# Altium schematic sheet pfe-final.SchDoc: Conception et réalisation d'un caractériseur des modles photovoltaiques
size A4; ApprovedBy: Hanen Zormati; CheckedBy: Hanen Zormati; CompanyName: CRMN; DrawnBy: Asma Boulajfene; Engineer: Embedded System; DocumentNumber: 1; SheetNumber: 1; SheetTotal: 1
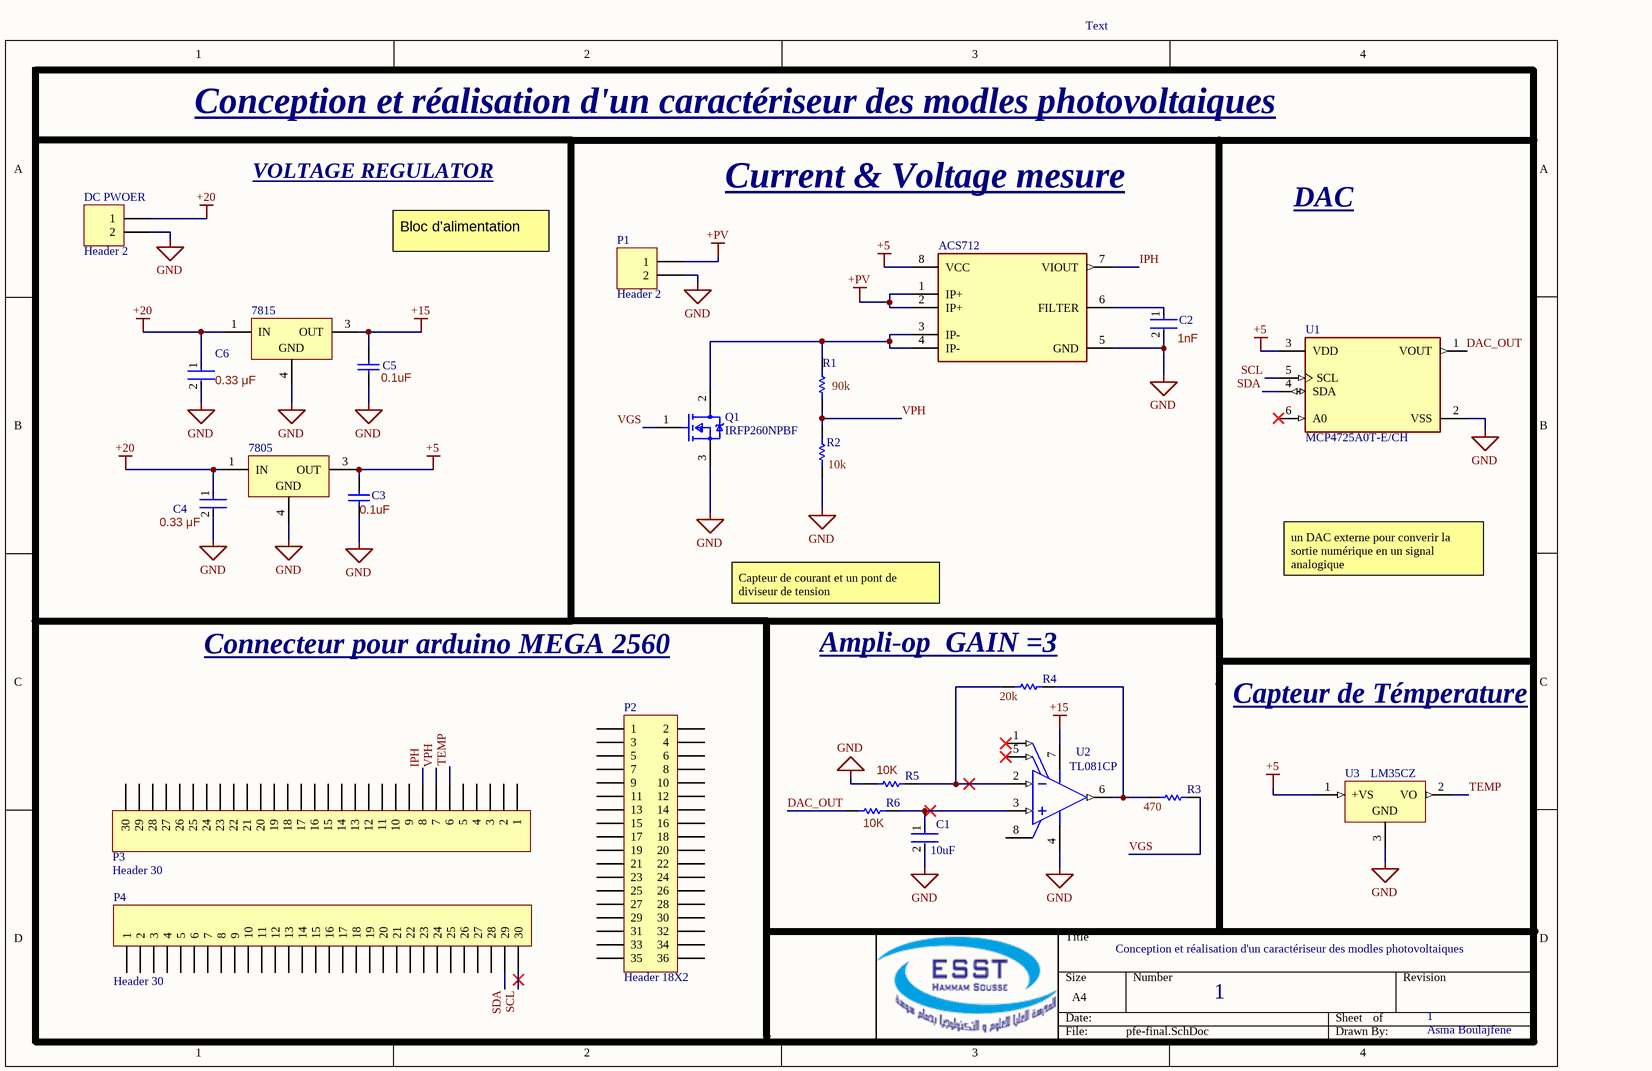
[diagram p0: pfe-final.SchDoc]

## Parts
7805  L7805CD2T-TR  [TO-263_M]  (value not drawn)
7815  L7815CD2T-TR  [TO-263_N]  (value not drawn)
ACS712  ACS712ELCTR-30A-T  [FP-LC-8-IPC_C]  (value not drawn)
C1  value 10uF  [FP-C0805C-DG-MFG]  (hidden comment: C0805C106K8PACTU)
C2  value 1nF  [FP-C0805C-DN-MFG]  (hidden comment: C0805C102J1GACTU)
C3  Capacitance: 0.1uF  [CAPC2013X135X45ML10T25]  (hidden comment: GRM21BR71H104KA01L)
C4  value 0.33 μF  [FP-C0805C-DN-MFG]  (hidden comment: C0805C334K5RACTU)
C5  Capacitance: 0.1uF  [CAPC2013X135X45ML10T25]  (hidden comment: GRM21BR71H104KA01L)
C6  value 0.33 μF  [FP-C0805C-DN-MFG]  (hidden comment: C0805C334K5RACTU)
DC_PWOER  Header 2  [HDR1X2]
P1  Header 2  [HDR1X2]
P2  Header 18X2  [HDR2X18]
P3  Header 30  [HDR1X30]
P4  Header 30  [HDR1X30]
Q1  IRFP260NPBF  [FP-PG-TO247-3-MFG]
R1  value 90k  [RESC0805(2012)_M]  (hidden comment: 150K 1% 0805(2012))
R2  value 10k  [RESC2013X60X35NL10T20]  (hidden comment: RC0805FR-0710KL)
R3  value 470  [RESC2013X60X35NL10T20]  (hidden comment: RC0805FR-0710KL)
R4  value 20k  [RESC2013X60X35NL10T20]  (hidden comment: RC0805FR-0710KL)
R5  value 10K  [RESC2013X60X35NL10T20]  (hidden comment: RC0805FR-0710KL)
R6  value 10K  [RESC2013X60X35NL10T20]  (hidden comment: RC0805FR-0710KL)
U1  MCP4725A0T-E/CH  [FP-C04-028-CHY-IPC_B]
U2  TL081CP  [P0008A]
U3  LM35CZ  [Z03A]

## Nets
+5: 7805.3(OUT) ACS712.8(VCC) C3.2 U1.3(VDD) U3.1(+VS)
+15: 7815.3(OUT) C5.2 U2.7(VCC+)
+20: 7805.1(IN) 7815.1(IN) C4.1 C6.1 DC_PWOER.1
+PV: ACS712.1(IP+) ACS712.2(IP+) P1.1
GND: 7805.4(GND) 7815.4(GND) ACS712.5(GND) C1.2 C2.2 C3.1 C4.2 C5.1 C6.2 DC_PWOER.2 P1.2 Q1.3(S) R2.1 R5.1 U1.2(VSS) U2.4(VCC-) U3.3(GND)
DAC_OUT: R6.1 U1.1(VOUT)
IPH: ACS712.7(VIOUT) P3.8
SCL: P4.30 U1.5(SCL)
SDA: P4.29 U1.4(SDA)
TEMP: P3.6 U3.2(VO)
VGS: Q1.1(G) R3.2
VPH: P3.7 R1.1 R2.2
NetACS712_3: ACS712.3(IP-) ACS712.4(IP-) Q1.2(D) R1.2
NetACS712_6: ACS712.6(FILTER) C2.1
NetC1_1: C1.1 R6.2 U2.3(IN+)
NetR3_1: R3.1 R4.2 U2.6(OUT)
NetR4_1: R4.1 R5.2 U2.2(IN-)

Not connected (* = marked no-connect by the designer): P2 1 2 3 4 5 6 7 8 9 10 11 12 13 14 15 16 17 18 19 20 21 22 23 24 25 26 27 28 29 30 31 32 33 34 35 36; P3 1 2 3 4 5 9 10 11 12 13 14 15 16 17 18 19 20 21 22 23 24 25 26 27 28 29 30; P4 1 2 3 4 5 6 7 8 9 10 11 12 13 14 15 16 17 18 19 20 21 22 23 24 25 26 27 28; U1 6(A0)*; U2 1(OFFSET_N1)* 5(OFFSET_N2)* 8(NC)

## Notes on the sheet
- Text
- Conception et réalisation d'un caractériseur des modles photovoltaiques
- VOLTAGE REGULATOR
- Current & Voltage mesure
- DAC
- Bloc d'alimentation
- Capteur de courant et un pont de diviseur de tension
- un DAC externe pour converir la sortie numérique en un signal analogique
- Connecteur pour arduino MEGA 2560
- (near R4) Ampli-op  GAIN =3
- Capteur de Témperature
- 1
- Asma Boulajfene

## Library data of the parts
7805 = CMP-0244-00213-1: Positive Voltage Regulator, 3-Pin D2PAK, Tape and Reel; PackageReference: TO-263; ComponentLink2URL: http://www.st.com/internet/com/TECHNICAL_RESOURCES/TECHNICAL_LITERATURE/DATASHEET/CD00000444.pdf; PackageDescription: 3-Pin Transistor Outline Package 2.54 mm Pitch, 15.4 mm Lead Span (D2PAK); DatasheetVersion: 16/11/2011; ComponentLink2Description: Datasheet; ComponentLink1Description: Manufacturer URL; PackageVersion: 2011; ComponentLink1URL: http://www.st.com
7815 = CMP-0244-00179-1: Positive Voltage Regulator, 3-Pin D2PAK, Tape and Reel; PackageReference: TO-263; ComponentLink2Description: Datasheet; ComponentLink1Description: Manufacturer URL; DatasheetVersion: 16/11/2011; PackageVersion: 2011; ComponentLink1URL: http://www.st.com; ComponentLink2URL: http://www.st.com/internet/com/TECHNICAL_RESOURCES/TECHNICAL_LITERATURE/DATASHEET/CD00000444.pdf; PackageDescription: 3-Pin Transistor Outline Package 2.54 mm Pitch, 15.4 mm Lead Span (D2PAK)
ACS712 = CMP-2000-04990-2: SENSOR CURRENT HALL 30A AC/DC; Bandwidth: 80kHz; Max Supply Current: 13mA; Linearity: 1.5%; Operating Supply Voltage: 5V; Quiescent Current: 10mA; Number of Channels: 1; Polarity: Bidirectional; Min Supply Voltage: 4.5V; Response Time: 5us; Sensitivity: 66mV/A; Max Supply Voltage: 5.5V; Current Sensing: 30A; REACH SVHC: No SVHC; Mount: Surface Mount; Max Operating Temperature: 85°C; Packaging: Cut Tape; Frequency: 80kHz; Series: -; Termination: SMD/SMT; RoHS Compliant: Yes; Number of Pins: 8; Package Quantity: 1; Accuracy: 1.5%; Lead Free: Lead Free; Case/Package: SOIC; Min Operating Temperature: -40°C; Output Current: 10mA
C1 = CMP-2007-03243-2: CAP CER 10UF 10V X5R 0805; Manufacturer: Kemet; 3DS Part Number: 220-00001; Tolerance: 10%; Temperature Coefficient: 15%; Material: Ceramic; Device Class L2: Capacitors; Device Class L1: Passive Components; ComponentLink2URL: https://content.kemet.com/datasheets/KEM_C1006_X5R_SMD.pdf; Height: 1.4mm; Lead Free: Yes; Manufacturer Part Number: C0805C106K8PACTU; Digikey Description: CAP CER 10UF 10V X5R 0805; Octopart: https://octopart.com/c0805c106k8pactu-kemet-98697; Capacitance: 10uF; Temperature Range Low: -55°C; Temperature: -55°C to +85°C; Automotive: No; Mouser Description: CAP CER 10UF 10V X5R 0805; Ipc Land Pattern Name: CAPC200125X125; Temperature Range High: +85°C; Voltage: 10V; RoHS: TRUE; Device Class L3: Ceramic Capacitors; ComponentLink2Description: Datasheet; Voltage Rating: 10V; Package: C0805C-DG; Temperature Characteristic: X5R; Category: Cap
C2 = CMP-2007-00233-2: CAP CER 1000PF 100V C0G/NP0 0805; Manufacturer: KEMET; Capacitance: 1,000 pF; Temperature Coefficient: 30ppm/°C; Material: Ceramic; Tolerance: 0.05; Temperature Characteristic: C0G; Device Class L2: Capacitors; Ipc Land Pattern Name: CAPC200125X78; Device Class L1: Passive Components; Package: C0805C-DN; Lead Free: Yes; ComponentLink2URL: https://content.kemet.com/datasheets/KEM_C1003_C0G_SMD.pdf; RoHS: TRUE; Mouser Description: Multilayer Ceramic Capacitors MLCC - SMD/SMT 100volts 1000pF C0G 5%; Octopart: https://octopart.com/c0805c102j1gactu-kemet-105157; Category: Cap; Digikey Description: CAP CER 1000PF 100V C0G/NP0 0805; Temperature Range High: +125°C; Automotive: No; Temperature: -55°C to +125°C; Height: 0.88mm; ComponentLink2Description: Datasheet; Manufacturer Part Number: C0805C102J1GACTU; Temperature Range Low: -55°C; Device Class L3: Ceramic Capacitors; Voltage Rating: 100 V
C3 C5 = CMP-2100-03644-1: Chip Capacitor, 0.1 uF, +/- 10%, 50 V, -55 to 125 degC, 0805 (2012 Metric), RoHS, Tape and Reel; Manufacturer: Murata; Voltage: 50V; Insulation Resistance: 10GR; Dielectric Material: Ceramic; Dielectric: X7R; Package Description: 2-Pin Surface Mount Device, Body 2 x 1.25 mm; Manufacturer URL: http://www.murata.com/; Case Code (Imperial): 0805; Datasheet URL: http://psearch.en.murata.com/capacitor/product/GRM21BR71H104KA01%23.pdf; Termination: SMD/SMT; Lead Free: LeadFree; Package Quantity: 1; Mount: SurfaceMount; REACH SVHC: Unknown; Thickness: 0.053inch; Height: 1.25mm; Case/Package: 0805; Voltage Rating: 50V; Width: 0.049inch; Case Code (Metric): 2012; Material: Ceramic; Min Operating Temperature: -55degC; RoHSCompliant: true; Datasheet Version: 42675.0; Voltage Rating (DC): 50V; Tolerance: 10%; Package Reference: 0805; Depth: 1.25mm; Length: 2mm; Max Operating Temperature: 125degC; Packaging: TapeandReel; Number of Pins: 2; Radiation Hardening: No
C4 C6 = CMP-1036-04607-3: CAP CER 0.33UF 50V X7R 0805; Manufacturer: KEMET; Temperature Coefficient: 30ppm/°C; Material: Ceramic; Tolerance: 0.1; Temperature: -55°C to +125°C; Temperature Range Low: -55°C; Voltage Rating: 50 V; Lead Free: Yes; Mouser Description: Multilayer Ceramic Capacitors MLCC - SMD/SMT 50volts 0.33uF 10% X7R; Manufacturer Part Number: C0805C334K5RACTU; Automotive: No; Package: C0805C-DN; Temperature Characteristic: X7R; Capacitance: 0.33 μF; Digikey Description: CAP CER 0.33UF 50V X7R 0805; Device Class L3: Ceramic Capacitors; Temperature Range High: +125°C; Category: Cap; Ipc Land Pattern Name: CAPC200125X78; ComponentLink2URL: https://content.kemet.com/datasheets/KEM_C1003_C0G_SMD.pdf; ComponentLink2Description: Datasheet; RoHS: TRUE; Device Class L1: Passive Components; Height: 0.88mm; Octopart: https://octopart.com/c0805c334k5ractu-kemet-10475704; Device Class L2: Capacitors
DC_PWOER P1 = Header 2: Header, 2-Pin; LatestRevisionDate: 17-Jul-2002; LatestRevisionNote: Re-released for DXP Platform.; Publisher: Altium Limited
P2 = Header 18X2: Header, 18-Pin, Dual row; LatestRevisionDate: 17-Jul-2002; LatestRevisionNote: Re-released for DXP Platform.; Publisher: Altium Limited
P3 P4 = Header 30: Header, 30-Pin; LatestRevisionDate: 17-Jul-2002; LatestRevisionNote: Re-released for DXP Platform.; Publisher: Altium Limited
Q1 = CMP-32901-000262-1: MOSFET N-CH 200V 50A TO247AC; Drain to Source Resistance: 40mR; Turn-On Delay Time: 17ns; Gate to Source Voltage (Vgs): 20V; Turn-Off Delay Time: 55ns; Max Power Dissipation: 300W; Element Configuration: Single; Input Capacitance: 4.057nF; Threshold Voltage: 4V; Width: 0.209inch; Max Operating Temperature: 175°C; Number of Pins: 3; Lead Free: Lead Free; Rds On Max: 40mR; Case/Package: TO-247; Continuous Drain Current (ID): 50A; Power Dissipation: 300W; RoHS Compliant: Yes; Min Operating Temperature: -55°C; Drain to Source Voltage (Vdss): 200V; Mount: Through Hole; REACH SVHC: No SVHC; Packaging: Bulk; Drain to Source Breakdown Voltage: 200V; Halogen Free: Not Halogen Free; Height: 0.799inch; Length: 0.625inch; Max Dual Supply Voltage: 200V
R1 = CMP-1013-00754-1: 150K 0.125W 1% 0805 (2012 Metric)  SMD; Case-EIA: 0805; Case-Metric: 2012; Technology: SMT; Tolerance: 1 %; Power: 0.125 W
R2-R6 = CMP-1659-00013-4: Chip Resistor, 10 KOhm, +/- 1%, 0.125 W, -55 to 155 degC, 0805 (2012 Metric), RoHS, Tape and Reel; Manufacturer: Yageo; Voltage Rating: 150 V; Mount: Surface Mount; ComponentLink1Description: Manufacturer URL; ComponentLink2URL: http://www.yageo.com/documents/recent/PYu-RC_Group_51_RoHS_L_04.pdf; Pins: 2; Length: 2 mm; Min Operating Temperature: -55 degC; Height: 0.5 mm; Mounting Technology: Surface Mount; RoHSCompliant: true; REACH SVHC: No SVHC; ComponentLink1URL: http://www.yageo.com/; Max Operating Temperature: 155 degC; PackageReference: 0805; DatasheetVersion: Rev. 4, 02/2016; Package Quantity: 5000; Packaging: Tape and Reel; ComponentLink2Description: Datasheet; PackageDescription: 2-Pin Surface Mounted Device, Body 2 x 1.25 mm
U1 = CMP-0188-00760-3: IC DAC 12BIT V-OUT SOT23-6; Number of Outputs: 1; Supply Type: Single; Integral Nonlinearity (INL): 14.5LSB; Polarity: Unipolar; Number of Bits: 12; Min Supply Voltage: 2.7V; Output Type: Voltage; Settling Time: 6us; Max Supply Voltage: 5.5V; Nominal Supply Current: 210uA; Resolution: 12b; Interface: I2C; Input Offset Voltage (Vos): 1.1mV; Radiation Hardening: No; Number of DAC Channels: 1; Length: 3.1mm; Number of D/A Converters: 1; Number of Pins: 6; Case/Package: SOT-23-6; Lead Free: Lead Free; Number of Channels: 1; Termination: SMD/SMT; Width: 1.8mm; Contact Plating: Tin; Package Quantity: 3000; Max Operating Temperature: 125°C; Min Operating Temperature: -40°C; REACH SVHC: No SVHC; Mount: Surface Mount; Height: 1.3mm; Packaging: Tape and Reel; Number of Converters: 1
U2 = CMP-0017-00937-2: JFET-Input Operational Amplifier, 7 to 36 V, 0 to 70 degC, 8-pin DIP (P8), Pb-Free (RoHS); Manufacturer: Texas Instruments; Rating: Military; GBW(Typ)(MHz): 3; Vio (25C)(Max)(mV): 15; CMRR(Min)(dB): 70; Slew Rate(Typ)(V/us): 13; IIB(Max)(pA): 400; Vn at 1kHz(Typ)(nV/rtHz): 18; Sub Family: General Purpose Amplifier, High Supply Voltage Amplifier (>=30V); Number of Channels: 1; Total Supply Voltage(Min)(+5V is 5, +/-5V is 10): 7; Total Supply Voltage(Max)(+5V is 5, +/-5V is 10): 36; Iq per channel(Max)(mA): 2.8; Eco-Plan: Pb-Free (RoHS); PackageReference: P0008A; ComponentLink3URL: http://www.ti.com/litv/pdf/mpdi001b; ComponentLink1URL: http://www.ti.com/; Mounting Technology: Through Hole; Code_JEDEC: MS-001; ComponentLink3Description: Package Specification; PartNumber: TL081CP; PackageVersion: 4040082/E, 04/2010; ComponentLink2Description: Datasheet; DatasheetVersion: SLOS081G; PackageDescription: 8-Pin Plastic In-Line, Body 9.59 x 6.35 mm, Pitch 2.54 mm; ComponentLink2URL: http://www.ti.com/lit/ds/symlink/tl081.pdf; Offset Drift(Typ)(uV/C): 18; ComponentLink1Description: Manufacturer URL
U3 = CMP-0066-00027-2: Precision Centigrade Temperature Sensor, 3-pin TO-92; Manufacturer: National Semiconductor; CompType: Temp Sensor IC; PowerWise: N; PackageTopMarking: NSXYTT*LM35*CZ; ComponentLink2URL: http://www.national.com/pf/LM/LM35.html; ComponentLink2Description: LM35 Web Page; PackageDescription: TO-92, Molded, 3 Lead; PackageVersion: revG, Sep-2000; PinCount: 3; ComponentLink1Description: LM35 Datasheet; RoHS: N; ComponentLink3URL: http://www.national.com/packaging/folders/z03a.html; ComponentLink1URL: http://www.national.com/ds/LM/LM35.pdf; Code_JEDEC: TO-226-AA; ComponentLink3Description: Z03A Package Page; RevisionNote: Component URLs added; PackageReference: Z03A; DatasheetVersion: Nov-2000